# EAGLE schematic Equemetico (EAGLE 9.5.2)
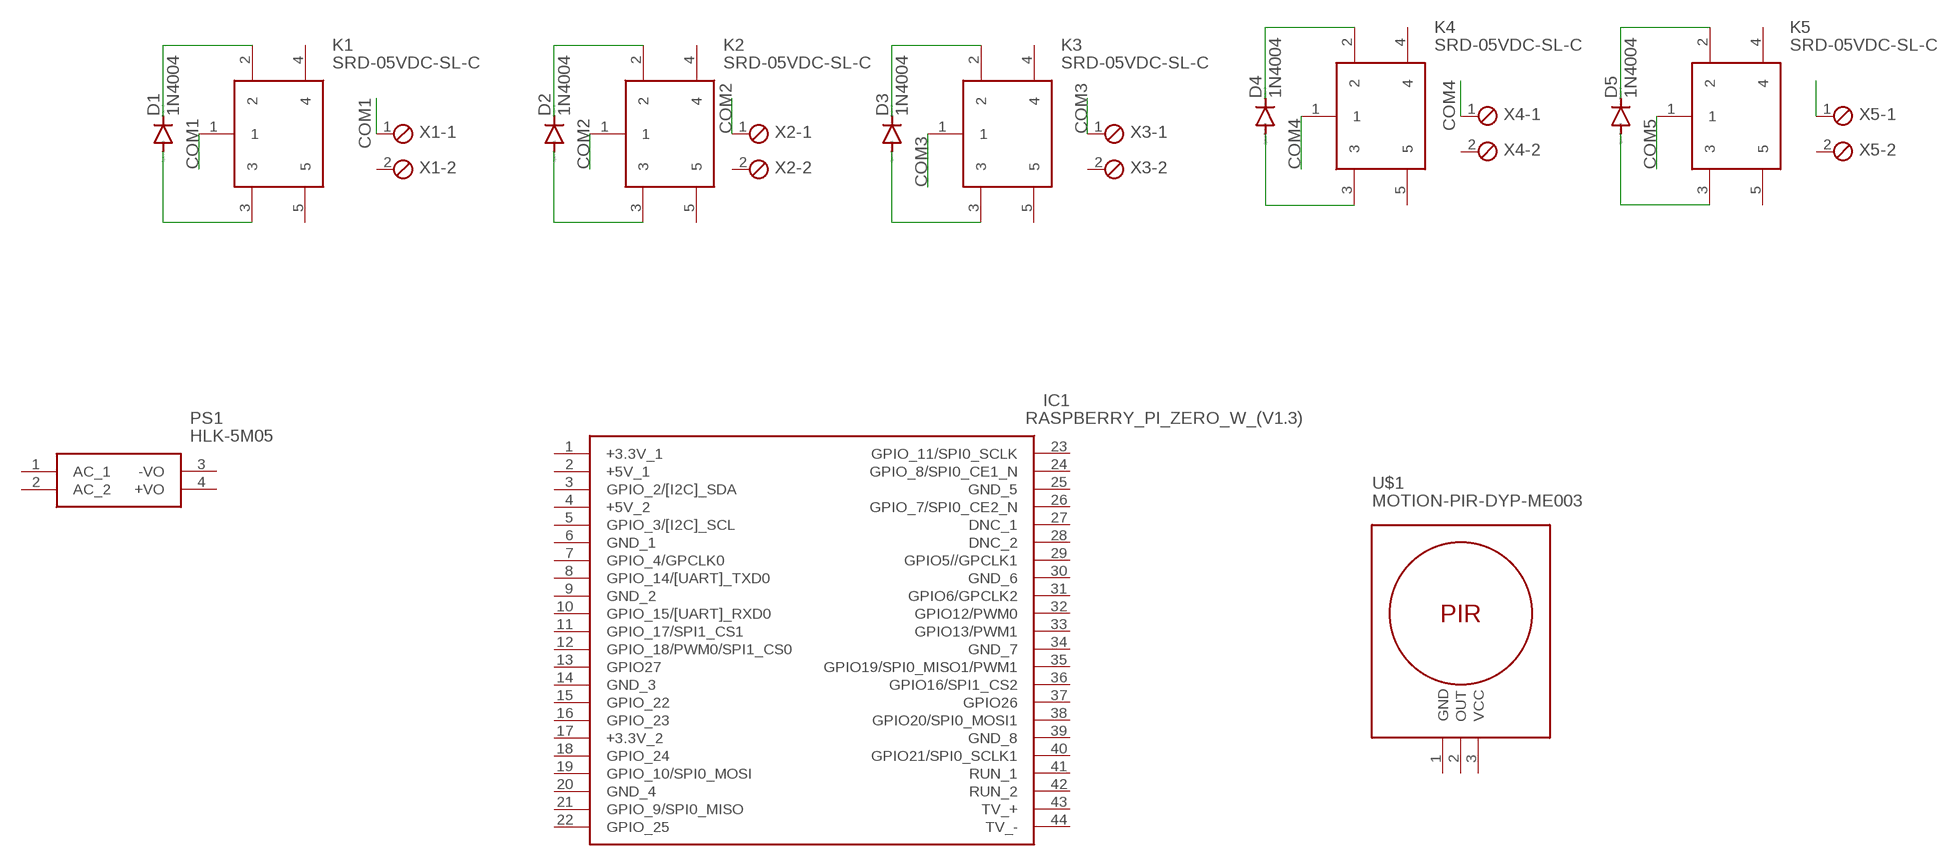
[diagram p0: schematic, sheet 1]

## Parts
D1  1N4004  [DO41-10]
D2  1N4004  [DO41-10]
D3  1N4004  [DO41-10]
D4  1N4004  [DO41-10]
D5  1N4004  [DO41-10]
IC1  RASPBERRY_PI_ZERO_W_(V1.3)  [RASPBERRYPIZEROWV13]
K1  SRD-05VDC-SL-C  [SRD]
K2  SRD-05VDC-SL-C  [SRD]
K3  SRD-05VDC-SL-C  [SRD]
K4  SRD-05VDC-SL-C  [SRD]
K5  SRD-05VDC-SL-C  [SRD]
PS1  HLK-5M05  [HLK5M05]
U$1  MOTION-PIR-DYP-ME003  [MOTION-PIR-DYP-ME003]
X1  MPT2  [2POL254]
X2  MPT2  [2POL254]
X3  MPT2  [2POL254]
X4  MPT2  [2POL254]
X5  MPT2  [2POL254]

## Nets
COM1: K1.1 X1.1
COM2: K2.1 X2.1
COM3: K3.1 X3.1
COM4: K4.1 X4.1
COM5: K5.1 X5.1
N$1: D1.C K1.2
N$2: D1.A K1.3
N$3: D2.C K2.2
N$4: D2.A K2.3
N$5: D3.C K3.2
N$6: D3.A K3.3
N$7: D4.C K4.2
N$8: D4.A K4.3
N$9: D5.C K5.2
N$10: D5.A K5.3
Unconnected: IC1.1(+3.3V_1) IC1.2(+5V_1) IC1.3(GPIO_2/[I2C]_SDA) IC1.4(+5V_2) IC1.5(GPIO_3/[I2C]_SCL) IC1.6(GND_1) IC1.7(GPIO_4/GPCLK0) IC1.8(GPIO_14/[UART]_TXD0) IC1.9(GND_2) IC1.10(GPIO_15/[UART]_RXD0) IC1.11(GPIO_17/SPI1_CS1) IC1.12(GPIO_18/PWM0/SPI1_CS0) IC1.13(GPIO27) IC1.14(GND_3) IC1.15(GPIO_22) IC1.16(GPIO_23) IC1.17(+3.3V_2) IC1.18(GPIO_24) IC1.19(GPIO_10/SPI0_MOSI) IC1.20(GND_4) IC1.21(GPIO_9/SPI0_MISO) IC1.22(GPIO_25) IC1.23(GPIO_11/SPI0_SCLK) IC1.24(GPIO_8/SPI0_CE1_N) IC1.25(GND_5) IC1.26(GPIO_7/SPI0_CE2_N) IC1.27(DNC_1) IC1.28(DNC_2) IC1.29(GPIO5//GPCLK1) IC1.30(GND_6) IC1.31(GPIO6/GPCLK2) IC1.32(GPIO12/PWM0) IC1.33(GPIO13/PWM1) IC1.34(GND_7) IC1.35(GPIO19/SPI0_MISO1/PWM1) IC1.36(GPIO16/SPI1_CS2) IC1.37(GPIO26) IC1.38(GPIO20/SPI0_MOSI1) IC1.39(GND_8) IC1.40(GPIO21/SPI0_SCLK1) IC1.41(RUN_1) IC1.42(RUN_2) IC1.43(TV_+) IC1.44(TV_-) K1.4 K1.5 K2.4 K2.5 K3.4 K3.5 K4.4 K4.5 K5.4 K5.5 PS1.1(AC_1) PS1.2(AC_2) PS1.3(-VO) PS1.4(+VO) U$1.2(OUT) X1.2 X2.2 X3.2 X4.2 X5.2

## Power pins joined to a net without a drawn wire
GND: U$1.1(GND)
VCC: U$1.3(VCC)

## Library data of the parts
D1-D5 = diode:1N4004: DIODE general purpose rectifier, 1 A
IC1 = Raspberry_Pi_Zero_W_(v1.3):RASPBERRY_PI_ZERO_W_(V1.3): Raspberry Pi Zero W (v1.3) Single-board Computers Source: Datasheet <https://cdn.sparkfun.com/assets/learn_tutorials/6/7/6/PiZero_1.pdf>; DESCRIPTION: Raspberry Pi Zero W (v1.3) Single-board Computers; HEIGHT: mm; MANUFACTURER_NAME: RASPBERRY-PI; MANUFACTURER_PART_NUMBER: Raspberry Pi Zero W (v1.3)
K1-K5 = SRD-05VDC-SL-C:SRD-05VDC-SL-C: Relay Source: Datasheet <http://files.microjpm.webnode.com/200001010-dda41de9e1/Songle Relay Datasheet.pdf>; DESCRIPTION: Relay; HEIGHT: mm; MANUFACTURER_NAME: Songle Relay; MANUFACTURER_PART_NUMBER: SRD-05VDC-SL-C
PS1 = HLK-5M05:HLK-5M05: 5W ultra-compact power module HLK-5M05 Source: Datasheet <https://hacktronics.co.in/step-down-power-supply/ac-dc-220v-ac-to-5v-dc-5w-pcb-mounted-plastics-enclosed-isolated-switching-step-down-power-supply-module>; DESCRIPTION: 5W ultra-compact power module HLK-5M05; HEIGHT: 18mm; MANUFACTURER_NAME: Hi-Link; MANUFACTURER_PART_NUMBER: HLK-5M05
U$1 = diy-modules:MOTION-PIR-DYP-ME003: PIR Motion Sensor Module DYP-ME003 based on BISS0001 pyroelectic detector Click here to find device on ebay.com <http://www.ebay.com/sch/dyp+me003>
X1-X5 = con-phoenix-254:MPT2: PHOENIX CONNECTOR; OC_FARNELL: unknown; OC_NEWARK: unknown